# EAGLE design EEGAmp_SMT_OPA4377 (EAGLE 9.6.2)
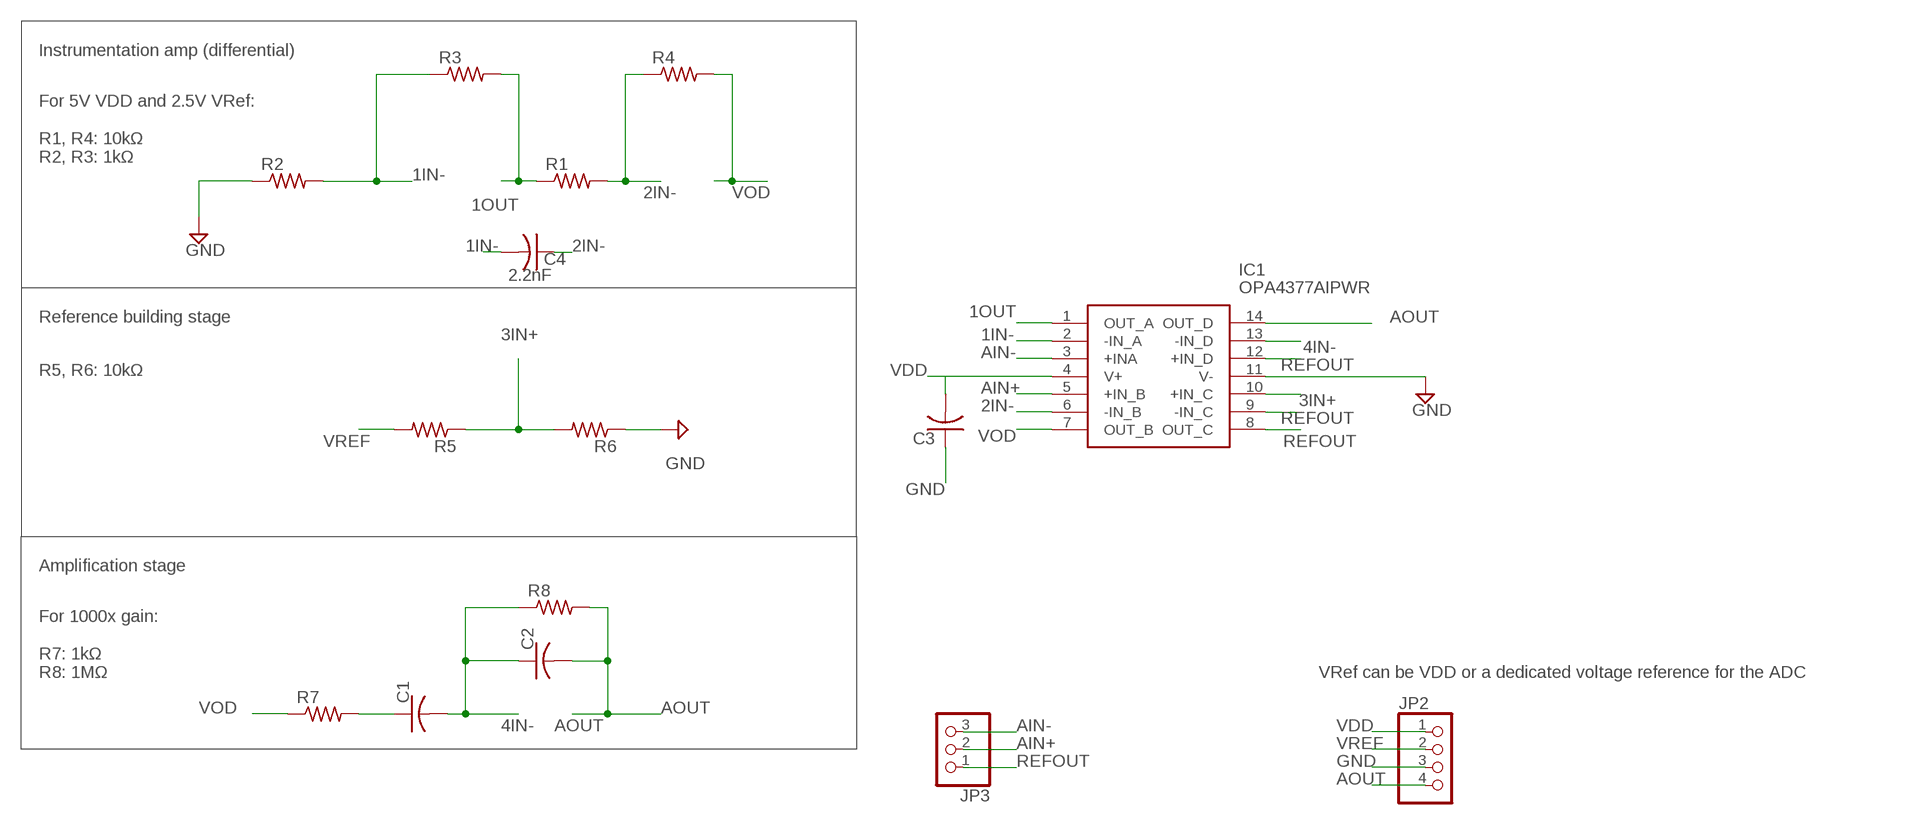
[diagram p0: schematic, sheet 1]

## Parts
C1  C-USC0402  [C0402]
C2  C-USC0402  [C0402]
C3  C-USC0402  [C0402]
C4  2.2nF  C-USC0402  [C0402]
IC1  OPA4377AIPWR  [SOP65P640X120-14N]
JP2  PINHD-1X4  [1X04]
JP3  PINHD-1X3  [1X03]
R1  R-US_R0402  [R0402]
R2  R-US_R0402  [R0402]
R3  R-US_R0402  [R0402]
R4  R-US_R0402  [R0402]
R5  R-US_R0402  [R0402]
R6  R-US_R0402  [R0402]
R7  R-US_R0402  [R0402]
R8  R-US_R0402  [R0402]

## Nets
1IN-: C4.2 IC1.2(-IN_A) R2.2 R3.1
1OUT: IC1.1(OUT_A) R1.1 R3.2
2IN-: C4.1 IC1.6(-IN_B) R1.2 R4.1
3IN+: IC1.10(+IN_C) R5.1 R6.2
4IN-: C1.2 C2.1 IC1.13(-IN_D) R8.1
AIN+: IC1.5(+IN_B) JP3.2
AIN-: IC1.3(+INA) JP3.3
AOUT: C2.2 IC1.14(OUT_D) JP2.4 R8.2
GND: C3.1 IC1.11(V-) JP2.3 R2.1 R6.1
N$9: C1.1 R7.2
REFOUT: IC1.8(OUT_C) IC1.9(-IN_C) IC1.12(+IN_D) JP3.1
VDD: C3.2 IC1.4(V+) JP2.1
VOD: IC1.7(OUT_B) R4.2 R7.1
VREF: JP2.2 R5.2

## Notes on the sheet
- Instrumentation amp (differential)
- For 5V VDD and 2.5V VRef:
  
  R1, R4: 10kΩ
  R2, R3: 1kΩ
- Reference building stage
- R5, R6: 10kΩ
- Amplification stage
- For 1000x gain:
  
  R7: 1kΩ
  R8: 1MΩ
- VRef can be VDD or a dedicated voltage reference for the ADC

## Library data of the parts
C1-C4 = rcl:C-US: CAPACITOR, American symbol; SPICEPREFIX: C
IC1 = OPA4377AIPWR:OPA4377AIPWR: Low-Cost, Low Noise, 5.5MHz CMOS Operational Amplifier Source: Datasheet <http://www.ti.com/lit/ds/symlink/opa4377.pdf>; DESCRIPTION: Low-Cost, Low Noise, 5.5MHz CMOS Operational Amplifier; HEIGHT: 1.2mm; MANUFACTURER_NAME: Texas Instruments; MANUFACTURER_PART_NUMBER: OPA4377AIPWR; MOUSER_PART_NUMBER: 595-OPA4377AIPWR; MOUSER_PRICE-STOCK: https://www.mouser.co.uk/ProductDetail/Texas-Instruments/OPA4377AIPWR?qs=yoyprvkDL1lk4GGp%252BnY4pg%3D%3D
JP2 = pinhead:PINHD-1X4: PIN HEADER
JP3 = pinhead:PINHD-1X3: PIN HEADER
R1-R8 = rcl:R-US_: RESISTOR, American symbol; SPICEPREFIX: R

## Board
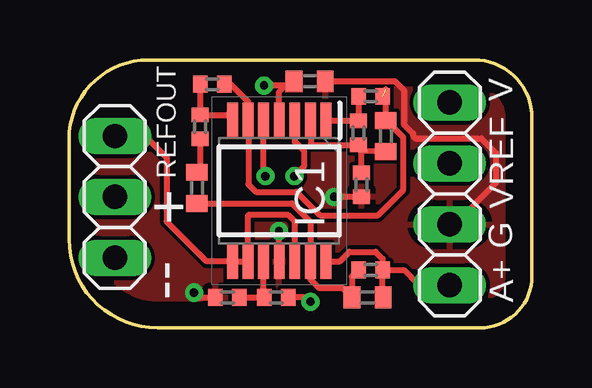
[diagram p1: board, top side]
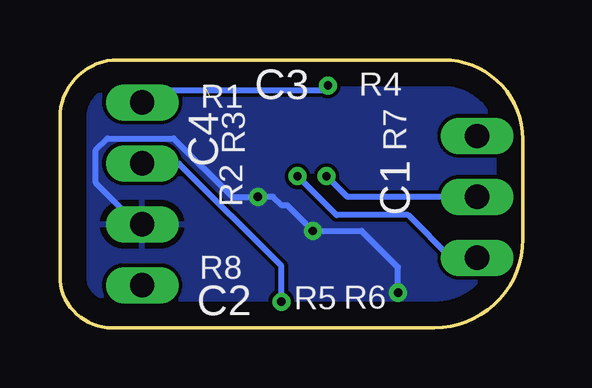
[diagram p2: board, bottom side, seen from below]

Size 19.3 x 11.18 mm. Coordinates in mm from the lower left corner, seen from the top.
Outline: 0,7.87 arc-90 3.3,11.18 16.89,11.18 arc-90 19.3,8.76 19.3,2.16 arc-90 17.15,0 3.68,0 arc-90 0,3.68 0,7.87
Copper layers (1*16): Top 0.035mm / dielectric 1.5mm / Bottom 0.035mm
Design rules "default": minimum track width 6mil, minimum drill 0.35mm, track to track 6mil, track to pad 6mil, pad to pad 6mil, via to via 6mil, smd to smd 6mil, copper to edge 40mil, drill to drill 6mil, minimum pad ring 10mil, minimum via ring 8mil, stop-mask expansion 4mil, vias tented up to drill 0mil, thermal gap 10mil

### Footprints (pad centres in the part's own frame; a part is rotated, then mirrored left to right if it is on the bottom)
C0402 = smd 0.7 x 0.9: 1 -0.65,0; 2 0.65,0
SOP65P640X120-14N = smd 1.475 x 0.45: 1 -2.938,1.95; 2 -2.938,1.3; 3 -2.938,0.65; 4 -2.938,0; 5 -2.938,-0.65; 6 -2.938,-1.3; 7 -2.938,-1.95; 8 2.938,-1.95; 9 2.938,-1.3; 10 2.938,-0.65; 11 2.938,0; 12 2.938,0.65; 13 2.938,1.3; 14 2.938,1.95
1X04 = drill 1.016 long: 1 -3.81,0; 2 -1.27,0; 3 1.27,0; 4 3.81,0
1X03 = drill 1.016 long: 1 -2.54,0; 2 0,0; 3 2.54,0
R0402 = smd 0.6 x 0.7: 1 -0.5,0; 2 0.5,0

### Placement (x,y rotation side)
C1  5.33,5.84 270 top
C2  12.45,1.27 0 top
C3  10.03,10.29 180 top
C4  13.21,8 270 top
IC1  8.76,5.71 270 top
JP2  15.88,5.59 270 top
JP3  1.91,5.46 270 top
R1  12.57,9.65 0 top
R2  12.19,5.97 90 top
R3  12.07,8.13 90 top
R4  5.97,10.16 180 top
R5  8.64,1.27 0 top
R6  6.6,1.27 0 top
R7  5.46,8.38 270 top
R8  12.57,2.41 0 top

### Tracks (layer width: path | path; a pad name or v marks a point on that pad's centre or on a via)
1IN-
  Top 0.254: IC1.2 10.08,8.63 10.08,7.67 10.13,7.63 R3.1 12.17,7.51 12.2,7.51 12.19,7.5 | C4.2 12.19,7.38 R2.2
1OUT
  Top 0.254: IC1.1 10.74,8.63 R3.2 R1.1
2IN-  (1 unrouted)
  Top 0.254: 13.2,9.96 13.21,9.95 C4.1 13.23,8.65 13.94,7.94 13.94,5.74 12.89,4.69 10.46,4.69 9.48,5.67 7.79,5.67 7.48,5.98 7.48,8.63 IC1.6 7.46,9.43 6.73,10.16 R4.1
3IN+
  Top 0.254: IC1.10 8.11,1.29 R5.1 R6.2
4IN-
  Top 0.254: R8.1 11.8,2.14 C2.1 11.42,1.65 10.44,1.65 10.06,2.02 IC1.13 10.06,4.42 9.29,5.19 C1.2
AIN+  (via drill 0.35)
  Top 0.254: v8.19,6.33 8.11,6.41 IC1.5
  Bottom 0.254: JP3.2 7.32,5.46 v8.19,6.33
AIN-  (via drill 0.35)
  Top 0.254: v9.4,6.33 9.79,6.73 9.79,7.38 9.41,7.76 IC1.3
  Bottom 0.254: JP3.3 3,2.92 4.78,4.7 7.77,4.7 v9.4,6.33
AOUT
  Top 0.254: 13.1,1.52 C2.2 13.07,1.29 R8.2 | IC1.14 11.29,2.78 11.68,3.18 12.78,3.18 13.07,2.88 R8.2 | R8.2 13.96,2.41 14.6,1.78 JP2.4
GND  (via drill 0.35)
  Top 0.254: IC1.11 v8.76,4.03 v8.76,4.04 | v5.21,1.47 5.41,1.27 R6.1 | v11.05,5.46 v11.06,5.47 R2.1 | C3.1 13.59,10.29 13.97,9.91 13.97,8.49 14.34,8.11 14.34,8.01 14.45,7.9 17.2,7.9 17.8,7.29 17.8,6.05 16.08,4.32 JP2.3
  Bottom 0.254: v5.21,1.47 5.21,2.53 6.72,4.04 v8.76,4.04 9.82,5.11 10.05,5.11 10.41,5.46 v11.05,5.46 12.12,5.46 14.56,7.9 17.32,7.9 17.8,7.42 17.8,6.05 16.08,4.32 JP2.3
  pour Bottom: 22.99,13.59 22.99,-2.41 -0.51,-2.41 -0.51,13.59
  pour Top: -0.76,13.21 22.73,13.21 22.73,-2.03 -0.76,-2.03
N$9
  Top 0.254: R7.2 5.46,6.62 C1.1
REFOUT
  Top 0.254: JP3.1 3.18,8 4.06,7.11 4.06,4.45 5.73,2.78 IC1.8 IC1.9 7.46,4.7 9.14,4.7 9.41,4.43 IC1.12
VDD  (via drill 0.35)
  Top 0.254: IC1.4 8.76,9.85 9.21,10.29 C3.2 9.2,10.11 v8.13,10.11
  Bottom 0.254: JP2.1 15.37,9.91 8.33,9.91 v8.13,10.11
VOD
  Top 0.254: R4.2 R7.1 6.58,8.88 IC1.7
VREF  (via drill 0.35)
  Top 0.254: v10.07,1.09 9.89,1.27 R5.2
  Bottom 0.254: JP2.2 14.35,6.86 10.07,2.57 v10.07,1.09

### Text on the board
tNames: V | REFOUT | VREF | + | G | -- | A+